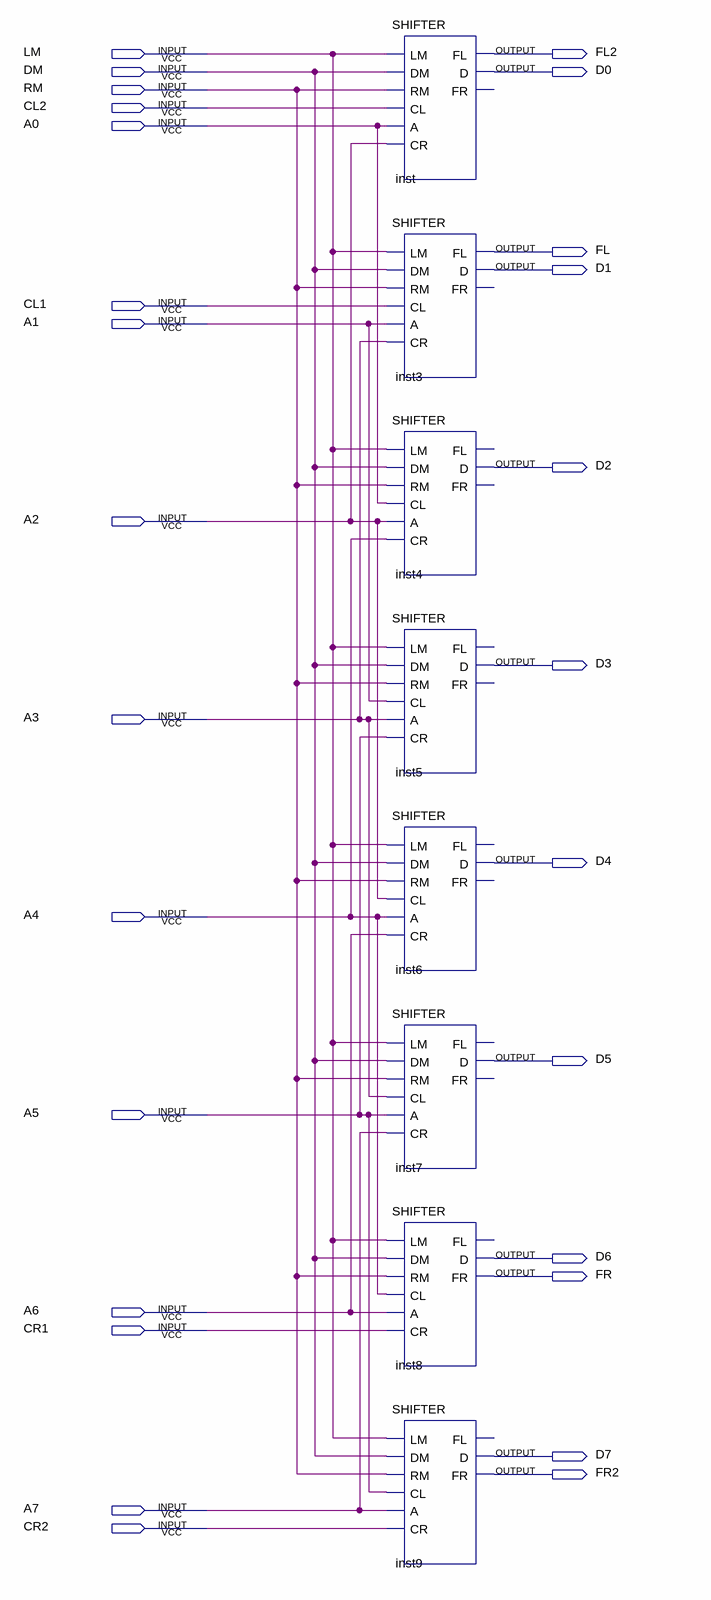
[diagram p0: schematic sheet]
// Quartus schematic SHIFTER8-2.bdf as structural Verilog: 8 symbols, 27 pins
module \SHIFTER8-2  (
  input  LM,
  input  DM,
  input  RM,
  input  CL2,
  input  A0,
  input  CL1,
  input  A1,
  input  A2,
  input  A3,
  input  A4,
  input  A5,
  input  A6,
  input  CR1,
  input  A7,
  input  CR2,
  output FL2,
  output D0,
  output FL,
  output D1,
  output D2,
  output D3,
  output D4,
  output D5,
  output D6,
  output FR,
  output D7,
  output FR2
);

  SHIFTER inst (.LM(LM), .DM(DM), .RM(RM), .CL(CL2), .A(A0), .CR(A2), .FL(FL2), .D(D0));  // open: FR
  SHIFTER inst3 (.LM(LM), .DM(DM), .RM(RM), .CL(CL1), .A(A1), .CR(A3), .FL(FL), .D(D1));  // open: FR
  SHIFTER inst4 (.LM(LM), .DM(DM), .RM(RM), .CL(A0), .A(A2), .CR(A4), .D(D2));  // open: FL, FR
  SHIFTER inst5 (.LM(LM), .DM(DM), .RM(RM), .CL(A1), .A(A3), .CR(A5), .D(D3));  // open: FL, FR
  SHIFTER inst6 (.LM(LM), .DM(DM), .RM(RM), .CL(A2), .A(A4), .CR(A6), .D(D4));  // open: FL, FR
  SHIFTER inst7 (.LM(LM), .DM(DM), .RM(RM), .CL(A3), .A(A5), .CR(A7), .D(D5));  // open: FL, FR
  SHIFTER inst8 (.LM(LM), .DM(DM), .RM(RM), .CL(A4), .A(A6), .CR(CR1), .D(D6), .FR(FR));  // open: FL
  SHIFTER inst9 (.LM(LM), .DM(DM), .RM(RM), .CL(A5), .A(A7), .CR(CR2), .D(D7), .FR(FR2));  // open: FL
endmodule
